# Altium schematic sheet 11.SchDoc
size A3
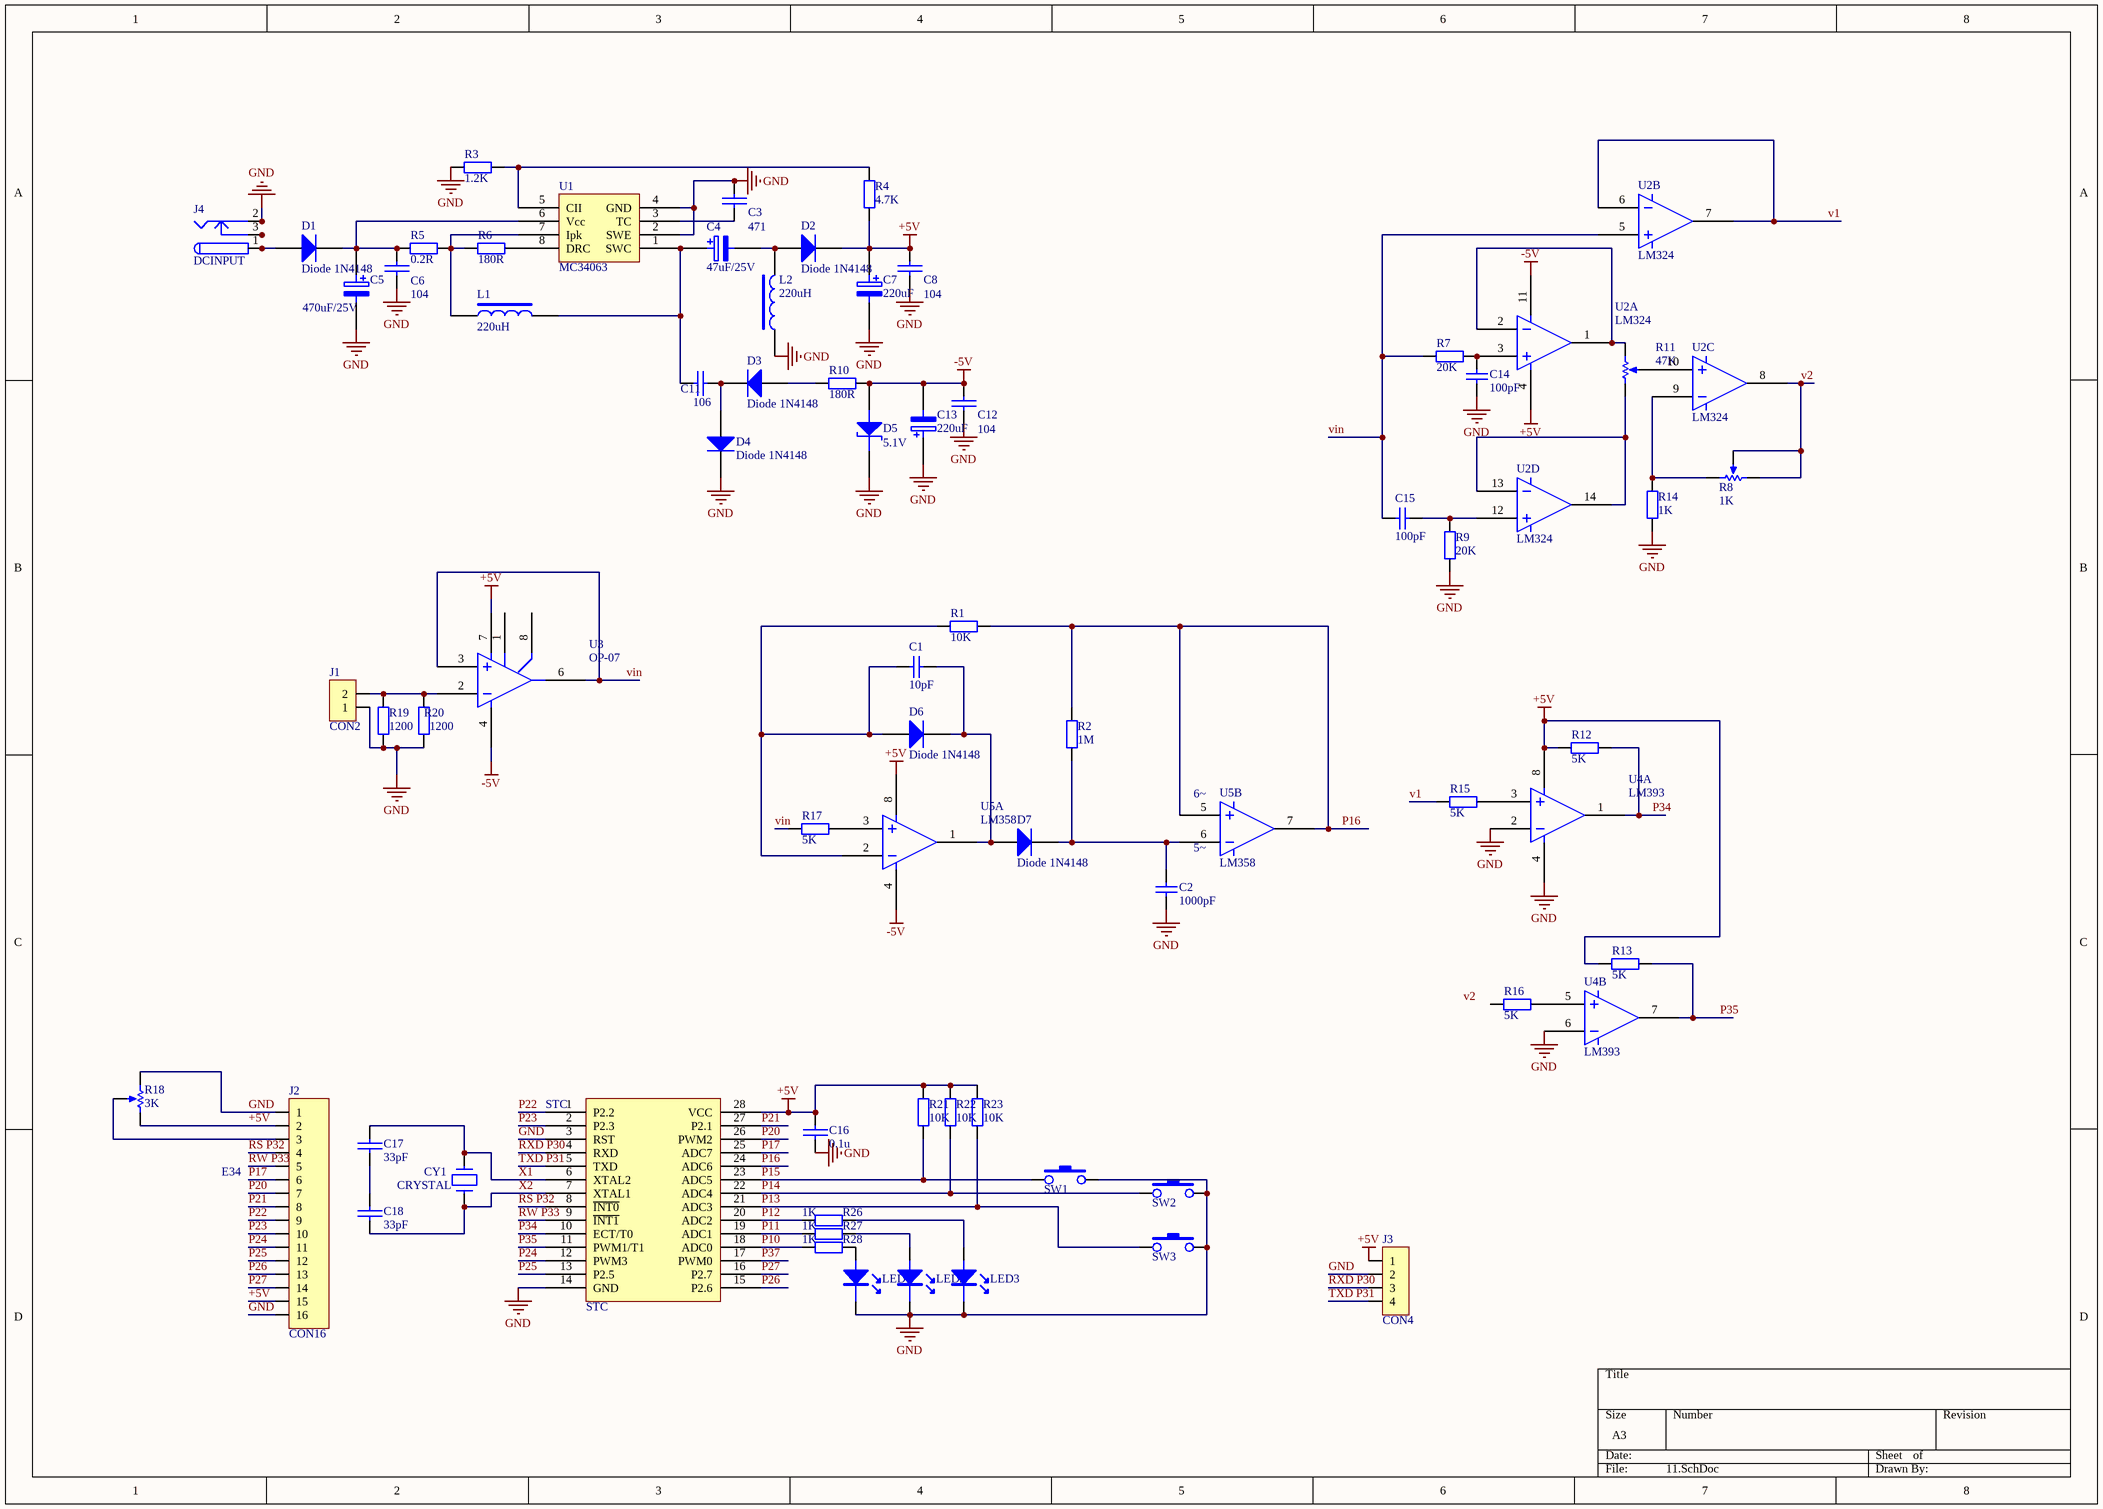
[diagram p0: 11.SchDoc]

## Parts
C1  value 10pF  [RAD-0.2]  (hidden comment: Cap)
C2  value 1000pF  [RAD-0.2]  (hidden comment: Cap)
C3  471  [RAD0.2]
C4  47uF/25V  [RB.2/.3]
C5  470uF/25V  [RB.2/.3]
C6  104  [RAD0.2]
C7  220uF  [RB.2/.3]
C8  104  [RAD0.2]
C11  106  [RAD0.2]
C12  104  [RAD0.2]
C13  220uF  [RB.2/.3]
C14  value 100pF  [RAD-0.2]  (hidden comment: Cap)
C15  value 100pF  [RAD-0.2]  (hidden comment: Cap)
C16  0.1u  [RAD0.2]
C17  33pF  [RAD0.2]
C18  33pF  [RAD0.2]
CY1  CRYSTAL  [CY2]
D1  Diode 1N4148  [DIODE-0.4]
D2  Diode 1N4148  [DIODE-0.4]
D3  Diode 1N4148  [DIODE-0.4]
D4  Diode 1N4148  [DIODE-0.4]
D5  5.1V  [AXIAL0.4]
D6  Diode 1N4148  [DIODE-0.4]
D7  Diode 1N4148  [DIODE-0.4]
J1  CON2  [SIP2]
J2  CON16  [SIP16]
J3  CON4  [SIP4]
J4  DCINPUT  [DC-INPUT]
L1  220uH  [RB.2/.4]
L2  220uH  [RB.2/.4]
LED1  LED  [LED]  (value not drawn)
LED2  LED  [LED]  (value not drawn)
LED3  LED  [LED]  (value not drawn)
R1  value 10K  [AXIAL-0.4]  (hidden comment: Res2)
R2  value 1M  [AXIAL-0.4]  (hidden comment: Res2)
R3  1.2K  [AXIAL-0.4]
R4  4.7K  [AXIAL-0.4]
R5  0.2R  [AXIAL-0.4]
R6  180R  [AXIAL-0.4]
R7  20K  [AXIAL-0.4]
R8  value 1K  [VR5]  (hidden comment: RPot)
R9  20K  [AXIAL-0.4]
R10  180R  [AXIAL-0.4]
R11  47K  [VR5]
R12  value 5K  [AXIAL-0.4]  (hidden comment: Res2)
R13  value 5K  [AXIAL-0.4]  (hidden comment: Res2)
R14  value 1K  [AXIAL-0.4]  (hidden comment: Res2)
R15  5K  [AXIAL-0.4]
R16  5K  [AXIAL-0.4]
R17  value 5K  [AXIAL-0.4]  (hidden comment: Res2)
R18  value 3K  [VR5]  (hidden comment: RPot)
R19  value 1200  [AXIAL-0.4]  (hidden comment: Res2)
R20  value 1200  [AXIAL-0.4]  (hidden comment: Res2)
R21  value 10K  [AXIAL-0.4]  (hidden comment: Res2)
R22  value 10K  [AXIAL-0.4]  (hidden comment: Res2)
R23  value 10K  [AXIAL-0.4]  (hidden comment: Res2)
R26  value 1K  [AXIAL-0.4]  (hidden comment: Res2)
R27  value 1K  [AXIAL-0.4]  (hidden comment: Res2)
R28  value 1K  [AXIAL-0.4]  (hidden comment: Res2)
STC  STC  [DIP28]
SW1  SW-PB  [SW-BP]  (value not drawn)
SW2  SW-PB  [SW-BP]  (value not drawn)
SW3  SW-PB  [SW-BP]  (value not drawn)
U1  MC34063  [DIP8]
U2  LM324  [DIP-14]  (parts A,B,C,D of 4)
U3  OP-07  [DIP-8]
U4  LM393  [DIP-8]  (parts A,B of 2)
U5  LM358  [DIP-8]  (parts A,B of 2)

## Nets
+5V: C7.1 C8.1 C16.1 D2.2(K) J2.2 J2.15 J3.1 R4.1 R12.1 R13.1 R18.2(BOT) R21.2 R22.2 R23.2 STC.28(VCC) U2.4 U3.7 U4.8 U5.8
-5V: C12.1 C13.2 D5.1(A) R10.1 U2.11 U3.4 U5.4
GND: C2.1 C3.1 C5.2 C6.2 C7.2 C8.2 C12.2 C13.1 C14.1 C16.2 D4.2(K) D5.2(K) J1.1 J2.1 J2.16 J3.2 J4.2 J4.2A J4.2B L2.1 LED1.K LED2.K LED3.K R3.1 R9.1 R14.1 R18.1(TOP) R19.1 R20.1 STC.3(RST) STC.14(GND) SW1.2 SW2.2 SW3.2 U1.2(SWE) U1.4(GND) U4.2 U4.4 U4.6
P10: R28.2 STC.18(ADC0)
P11: R27.2 STC.19(ADC1)
P12: R26.2 STC.20(ADC2)
P13: R23.1 STC.21(ADC3) SW3.1
P14: R22.1 STC.22(ADC4) SW2.1
P15: R21.1 STC.23(ADC5) SW1.1
P16: R1.2 R2.2 STC.24(ADC6) U5.5 U5.7
P17: J2.6 STC.25(ADC7)
P20: J2.7 STC.26(PWM2)
P21: J2.8 STC.27(P2.1)
P22: J2.9 STC.1(P2.2)
P23: J2.10 STC.2(P2.3)
P24: J2.11 STC.12(PWM3)
P25: J2.12 STC.13(P2.5)
P26: J2.13 STC.15(P2.6)
P27: J2.14 STC.16(P2.7)
P34: R12.2 STC.10(ECT/T0) U4.1
P35: R13.2 STC.11(PWM1/T1) U4.7
P37: STC.17(PWM0)
RS P32: J2.4 STC.8(~{INT0})
RW P33: J2.5 STC.9(~{INT1})
RXD P30: J3.3 STC.4(RXD)
TXD P31: J3.4 STC.5(TXD)
v1: R15.2 U2.6 U2.7
v2: R8.1(TOP) R8.3(TAP) U2.8
vin: C15.1 R7.2 R17.2 U2.5 U3.3 U3.6
X1: C17.1 CY1.2 STC.6(XTAL2)
X2: C18.2 CY1.1 STC.7(XTAL1)
NetC1_1: C1.1 D6.1(A) R1.1 U5.2
NetC1_2: C1.2 D6.2(K) D7.1(A) U5.1
NetC2_2: C2.2 D7.2(K) R2.1 U5.6
NetC3_2: C3.2 U1.3(TC)
NetC4_1: C4.1 C11.1 L1.2 U1.1(SWC)
NetC4_2: C4.2 D2.1(A) L2.2
NetC5_1: C5.1 C6.1 D1.2(K) R5.1 U1.6(Vcc)
NetC11_2: C11.2 D3.2(K) D4.1(A)
NetC14_2: C14.2 R7.1 U2.3
NetC15_2: C15.2 R9.2 U2.12
NetC17_2: C17.2 C18.1
NetD1_1: D1.1(A) J4.1 J4.1A J4.1B
NetD3_1: D3.1(A) R10.2
NetJ1_2: J1.2 R19.2 R20.2 U3.2
NetJ2_3: J2.3 R18.3(TAP)
NetJ4_3: J4.3 J4.3A J4.3B
NetL1_1: L1.1 R5.2 R6.1 U1.7(Ipk)
NetLED1_A: LED1.A R28.1
NetLED2_A: LED2.A R27.1
NetLED3_A: LED3.A R26.1
NetR3_2: R3.2 R4.2 U1.5(CII)
NetR6_2: R6.2 U1.8(DRC)
NetR8_2: R8.2(BOT) R14.2 U2.9
NetR11_1: R11.1(TOP) U2.13 U2.14
NetR11_2: R11.2(BOT) U2.1 U2.2
NetR11_3: R11.3(TAP) U2.10
NetR15_1: R15.1 U4.3
NetR16_1: R16.1 U4.5
NetR17_1: R17.1 U5.3

Not connected (* = marked no-connect by the designer): R16 2; U3 1 8

## Notes on the sheet
- (near U5) 5~
- (near U5) 6~
- (near J2) E34
- Labels drawn without touching a wire or pin: v2

## Library data of the parts
C1 C2 C14 C15 = Cap: Capacitor; Published: 8-Jun-2000; LatestRevisionDate: 17-Jul-2002; LatestRevisionNote: Re-released for DXP Platform.; PackageReference: RAD-0.3; Publisher: Altium Limited
C3 C6 C8 C11 C12 = CAP: Capacitor
C4 C5 C7 C13 = ELECTRO2: Electrolytic Capacitor
C16-C18 = CAP
D1-D4 D6 D7 = Diode 1N4148: High Conductance Fast Diode; Published: 8-Jun-2000; LatestRevisionDate: 17-Jul-2002; LatestRevisionNote: Re-released for DXP Platform.; DatasheetDocument: 1997; PackageReference: DO-35; Publisher: Altium Limited; Code_JEDEC: DO-204-AH; ComponentLink1Description: Manufacturer Link; ComponentLink1URL: http://www.fairchildsemi.com/; ComponentLink2Description: Datasheet; ComponentLink2URL: http://www.fairchildsemi.com/ds/1N%2F1N4148.pdf
D5 = ZENER2: Zener Diode
J4 = PWR2.5: Low Voltage Power Supply Connector; Published: 17-Dec-2003; DatasheetDocument: 09-May-2002; Publisher: Altium Limited; ComponentLink1Description: Manufacturer Link; ComponentLink1URL: http://domino.kycon.com/internet/Products.html
L1 L2 = INDUCTOR2
R1-R3 R12-R14 R17 R19-R23 R26-R28 = Res2: Resistor; Published: 8-Jun-2000; LatestRevisionDate: 17-Jul-2002; LatestRevisionNote: Re-released for DXP Platform.; PackageReference: AXIAL-0.4; Publisher: Altium Limited
R4-R7 R9 R10 R15 R16 = Res2: Resistor; Value: 1K; Published: 8-Jun-2000; LatestRevisionDate: 17-Jul-2002; LatestRevisionNote: Re-released for DXP Platform.; PackageReference: AXIAL-0.4; Publisher: Altium Limited
R8 R18 = RPot: Potentiometer; Sim Note: Enter the Resistance value and the set point into parameter fields.; Set Position: 0.5; Published: 8-Jun-2000; LatestRevisionDate: 17-Jul-2002; LatestRevisionNote: Re-released for DXP Platform.; PackageReference: VR5; Publisher: Altium Limited
R11 = RPot: Potentiometer; Sim Note: Enter the Resistance value and the set point into parameter fields.; Set Position: 0.5; Value: 1K; Published: 8-Jun-2000; LatestRevisionDate: 17-Jul-2002; LatestRevisionNote: Re-released for DXP Platform.; PackageReference: VR5; Publisher: Altium Limited
STC = Component_1